# Altium schematic sheet decoupling.SchDoc: Decoupling Capacitors
size Legal; CheckedBy: J. Brinton; CompanyName: Signal Laboratories, Inc.; DrawnBy: J. Brinton; Engineer: J. Brinton; Address1: 3479 Edison Way; Address2: Menlo Park CA 94025; Address3: +1 (877) 778-8435; Address4: siglabs.com; Revision: 3; SheetNumber: 44; SheetTotal: 45
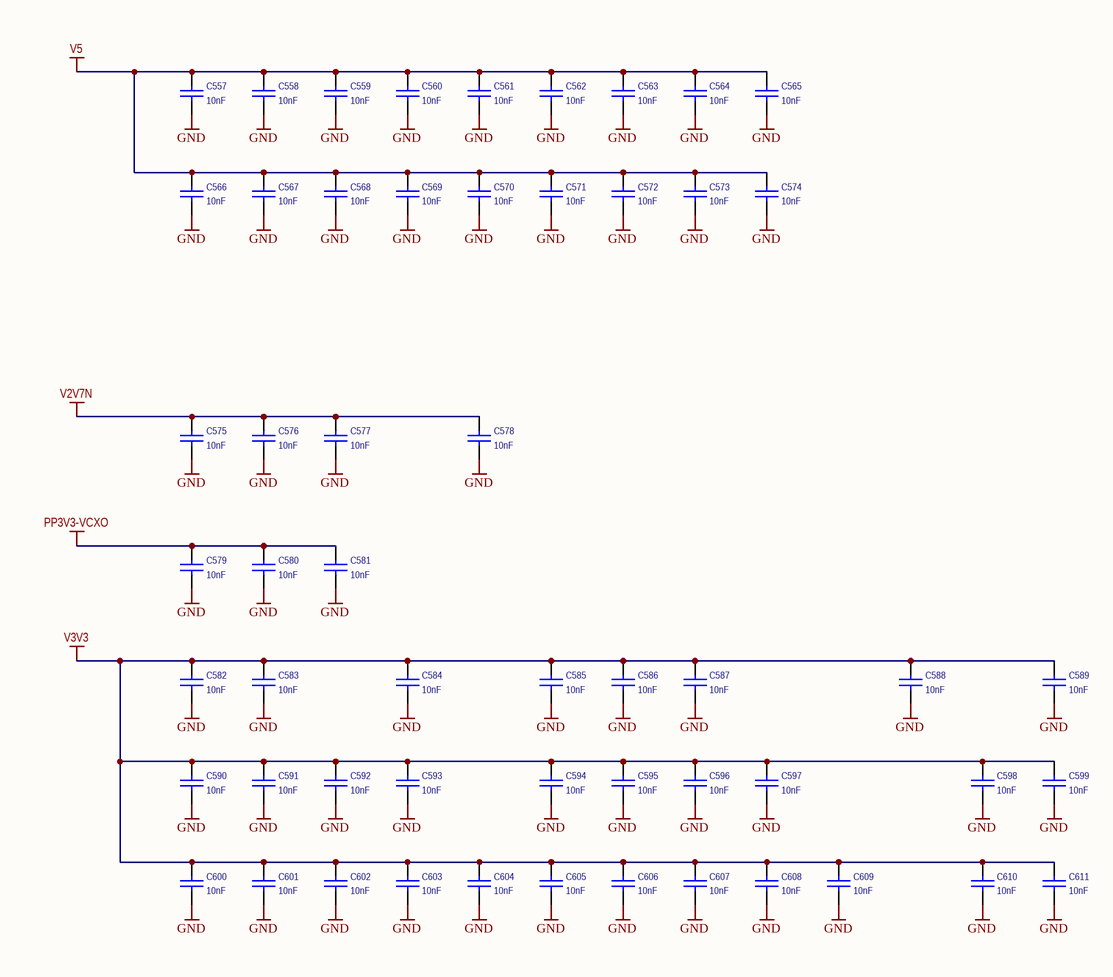
[diagram p0: decoupling.SchDoc]

## Parts
C557  value 10nF  [CAPC100X50X55L25N]  (hidden comment: GRM155R71H103KA88)
C558  value 10nF  [CAPC100X50X55L25N]  (hidden comment: GRM155R71H103KA88)
C559  value 10nF  [CAPC100X50X55L25N]  (hidden comment: GRM155R71H103KA88)
C560  value 10nF  [CAPC100X50X55L25N]  (hidden comment: GRM155R71H103KA88)
C561  value 10nF  [CAPC100X50X55L25N]  (hidden comment: GRM155R71H103KA88)
C562  value 10nF  [CAPC100X50X55L25N]  (hidden comment: GRM155R71H103KA88)
C563  value 10nF  [CAPC100X50X55L25N]  (hidden comment: GRM155R71H103KA88)
C564  value 10nF  [CAPC100X50X55L25N]  (hidden comment: GRM155R71H103KA88)
C565  value 10nF  [CAPC100X50X55L25N]  (hidden comment: GRM155R71H103KA88)
C566  value 10nF  [CAPC100X50X55L25N]  (hidden comment: GRM155R71H103KA88)
C567  value 10nF  [CAPC100X50X55L25N]  (hidden comment: GRM155R71H103KA88)
C568  value 10nF  [CAPC100X50X55L25N]  (hidden comment: GRM155R71H103KA88)
C569  value 10nF  [CAPC100X50X55L25N]  (hidden comment: GRM155R71H103KA88)
C570  value 10nF  [CAPC100X50X55L25N]  (hidden comment: GRM155R71H103KA88)
C571  value 10nF  [CAPC100X50X55L25N]  (hidden comment: GRM155R71H103KA88)
C572  value 10nF  [CAPC100X50X55L25N]  (hidden comment: GRM155R71H103KA88)
C573  value 10nF  [CAPC100X50X55L25N]  (hidden comment: GRM155R71H103KA88)
C574  value 10nF  [CAPC100X50X55L25N]  (hidden comment: GRM155R71H103KA88)
C575  value 10nF  [CAPC100X50X55L25N]  (hidden comment: GRM155R71H103KA88)
C576  value 10nF  [CAPC100X50X55L25N]  (hidden comment: GRM155R71H103KA88)
C577  value 10nF  [CAPC100X50X55L25N]  (hidden comment: GRM155R71H103KA88)
C578  value 10nF  [CAPC100X50X55L25N]  (hidden comment: GRM155R71H103KA88)
C579  value 10nF  [CAPC100X50X55L25N]  (hidden comment: GRM155R71H103KA88)
C580  value 10nF  [CAPC100X50X55L25N]  (hidden comment: GRM155R71H103KA88)
C581  value 10nF  [CAPC100X50X55L25N]  (hidden comment: GRM155R71H103KA88)
C582  value 10nF  [CAPC100X50X55L25N]  (hidden comment: GRM155R71H103KA88)
C583  value 10nF  [CAPC100X50X55L25N]  (hidden comment: GRM155R71H103KA88)
C584  value 10nF  [CAPC100X50X55L25N]  (hidden comment: GRM155R71H103KA88)
C585  value 10nF  [CAPC100X50X55L25N]  (hidden comment: GRM155R71H103KA88)
C586  value 10nF  [CAPC100X50X55L25N]  (hidden comment: GRM155R71H103KA88)
C587  value 10nF  [CAPC100X50X55L25N]  (hidden comment: GRM155R71H103KA88)
C588  value 10nF  [CAPC100X50X55L25N]  (hidden comment: GRM155R71H103KA88)
C589  value 10nF  [CAPC100X50X55L25N]  (hidden comment: GRM155R71H103KA88)
C590  value 10nF  [CAPC100X50X55L25N]  (hidden comment: GRM155R71H103KA88)
C591  value 10nF  [CAPC100X50X55L25N]  (hidden comment: GRM155R71H103KA88)
C592  value 10nF  [CAPC100X50X55L25N]  (hidden comment: GRM155R71H103KA88)
C593  value 10nF  [CAPC100X50X55L25N]  (hidden comment: GRM155R71H103KA88)
C594  value 10nF  [CAPC100X50X55L25N]  (hidden comment: GRM155R71H103KA88)
C595  value 10nF  [CAPC100X50X55L25N]  (hidden comment: GRM155R71H103KA88)
C596  value 10nF  [CAPC100X50X55L25N]  (hidden comment: GRM155R71H103KA88)
C597  value 10nF  [CAPC100X50X55L25N]  (hidden comment: GRM155R71H103KA88)
C598  value 10nF  [CAPC100X50X55L25N]  (hidden comment: GRM155R71H103KA88)
C599  value 10nF  [CAPC100X50X55L25N]  (hidden comment: GRM155R71H103KA88)
C600  value 10nF  [CAPC100X50X55L25N]  (hidden comment: GRM155R71H103KA88)
C601  value 10nF  [CAPC100X50X55L25N]  (hidden comment: GRM155R71H103KA88)
C602  value 10nF  [CAPC100X50X55L25N]  (hidden comment: GRM155R71H103KA88)
C603  value 10nF  [CAPC100X50X55L25N]  (hidden comment: GRM155R71H103KA88)
C604  value 10nF  [CAPC100X50X55L25N]  (hidden comment: GRM155R71H103KA88)
C605  value 10nF  [CAPC100X50X55L25N]  (hidden comment: GRM155R71H103KA88)
C606  value 10nF  [CAPC100X50X55L25N]  (hidden comment: GRM155R71H103KA88)
C607  value 10nF  [CAPC100X50X55L25N]  (hidden comment: GRM155R71H103KA88)
C608  value 10nF  [CAPC100X50X55L25N]  (hidden comment: GRM155R71H103KA88)
C609  value 10nF  [CAPC100X50X55L25N]  (hidden comment: GRM155R71H103KA88)
C610  value 10nF  [CAPC100X50X55L25N]  (hidden comment: GRM155R71H103KA88)
C611  value 10nF  [CAPC100X50X55L25N]  (hidden comment: GRM155R71H103KA88)

## Nets
GND: C557.1 C558.1 C559.1 C560.1 C561.1 C562.1 C563.1 C564.1 C565.1 C566.1 C567.1 C568.1 C569.1 C570.1 C571.1 C572.1 C573.1 C574.1 C575.1 C576.1 C577.1 C578.1 C579.1 C580.1 C581.1 C582.1 C583.1 C584.1 C585.1 C586.1 C587.1 C588.1 C589.1 C590.1 C591.1 C592.1 C593.1 C594.1 C595.1 C596.1 C597.1 C598.1 C599.1 C600.1 C601.1 C602.1 C603.1 C604.1 C605.1 C606.1 C607.1 C608.1 C609.1 C610.1 C611.1
PP3V3-VCXO: C579.2 C580.2 C581.2
V2V7N: C575.2 C576.2 C577.2 C578.2
V3V3: C582.2 C583.2 C584.2 C585.2 C586.2 C587.2 C588.2 C589.2 C590.2 C591.2 C592.2 C593.2 C594.2 C595.2 C596.2 C597.2 C598.2 C599.2 C600.2 C601.2 C602.2 C603.2 C604.2 C605.2 C606.2 C607.2 C608.2 C609.2 C610.2 C611.2
V5: C557.2 C558.2 C559.2 C560.2 C561.2 C562.2 C563.2 C564.2 C565.2 C566.2 C567.2 C568.2 C569.2 C570.2 C571.2 C572.2 C573.2 C574.2

## Library data of the parts
C557-C611 = CAP 0402: Ceramic Capacitor 10nF ±10% 50V X7R 0402; Manufacturer: Murata; Tr: -55:125; Voltage: 50V; Manufacturer P/N: GRM155R71H103KA88; Package: 0402; Tolerance: ±10%